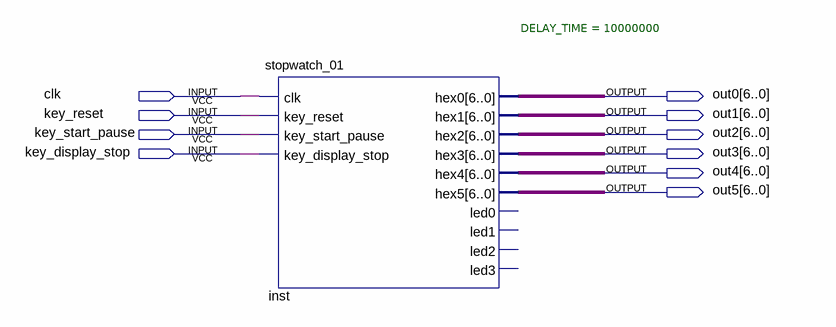
[diagram p0: schematic sheet]
// Quartus schematic timeCounter.bdf as structural Verilog: 1 symbols, 10 pins
module timeCounter (
  input  clk,
  input  key_reset,
  input  key_start_pause,
  input  key_display_stop,
  output [6:0] out0,
  output [6:0] out1,
  output [6:0] out2,
  output [6:0] out3,
  output [6:0] out4,
  output [6:0] out5
);

  stopwatch_01 #(.DELAY_TIME(10000000)) inst (
    .clk(clk), .key_reset(key_reset), .key_start_pause(key_start_pause), .key_display_stop(key_display_stop),
    .hex0(out0), .hex1(out1), .hex2(out2), .hex3(out3), .hex4(out4), .hex5(out5));  // open: led0, led1, led2, led3
endmodule
